# Altium schematic sheet DM3370_PCIe.SchDoc: =project_title
size Tabloid; CompanyName: Luxonis Holding; Organization: Luxonis Holding; Address1: 1925 Harmony Park Drive; Address2: Westminster, CO; Address3: 80234; Address4: United States; DocumentNumber: 12; SheetNumber: 12; SheetTotal: 17
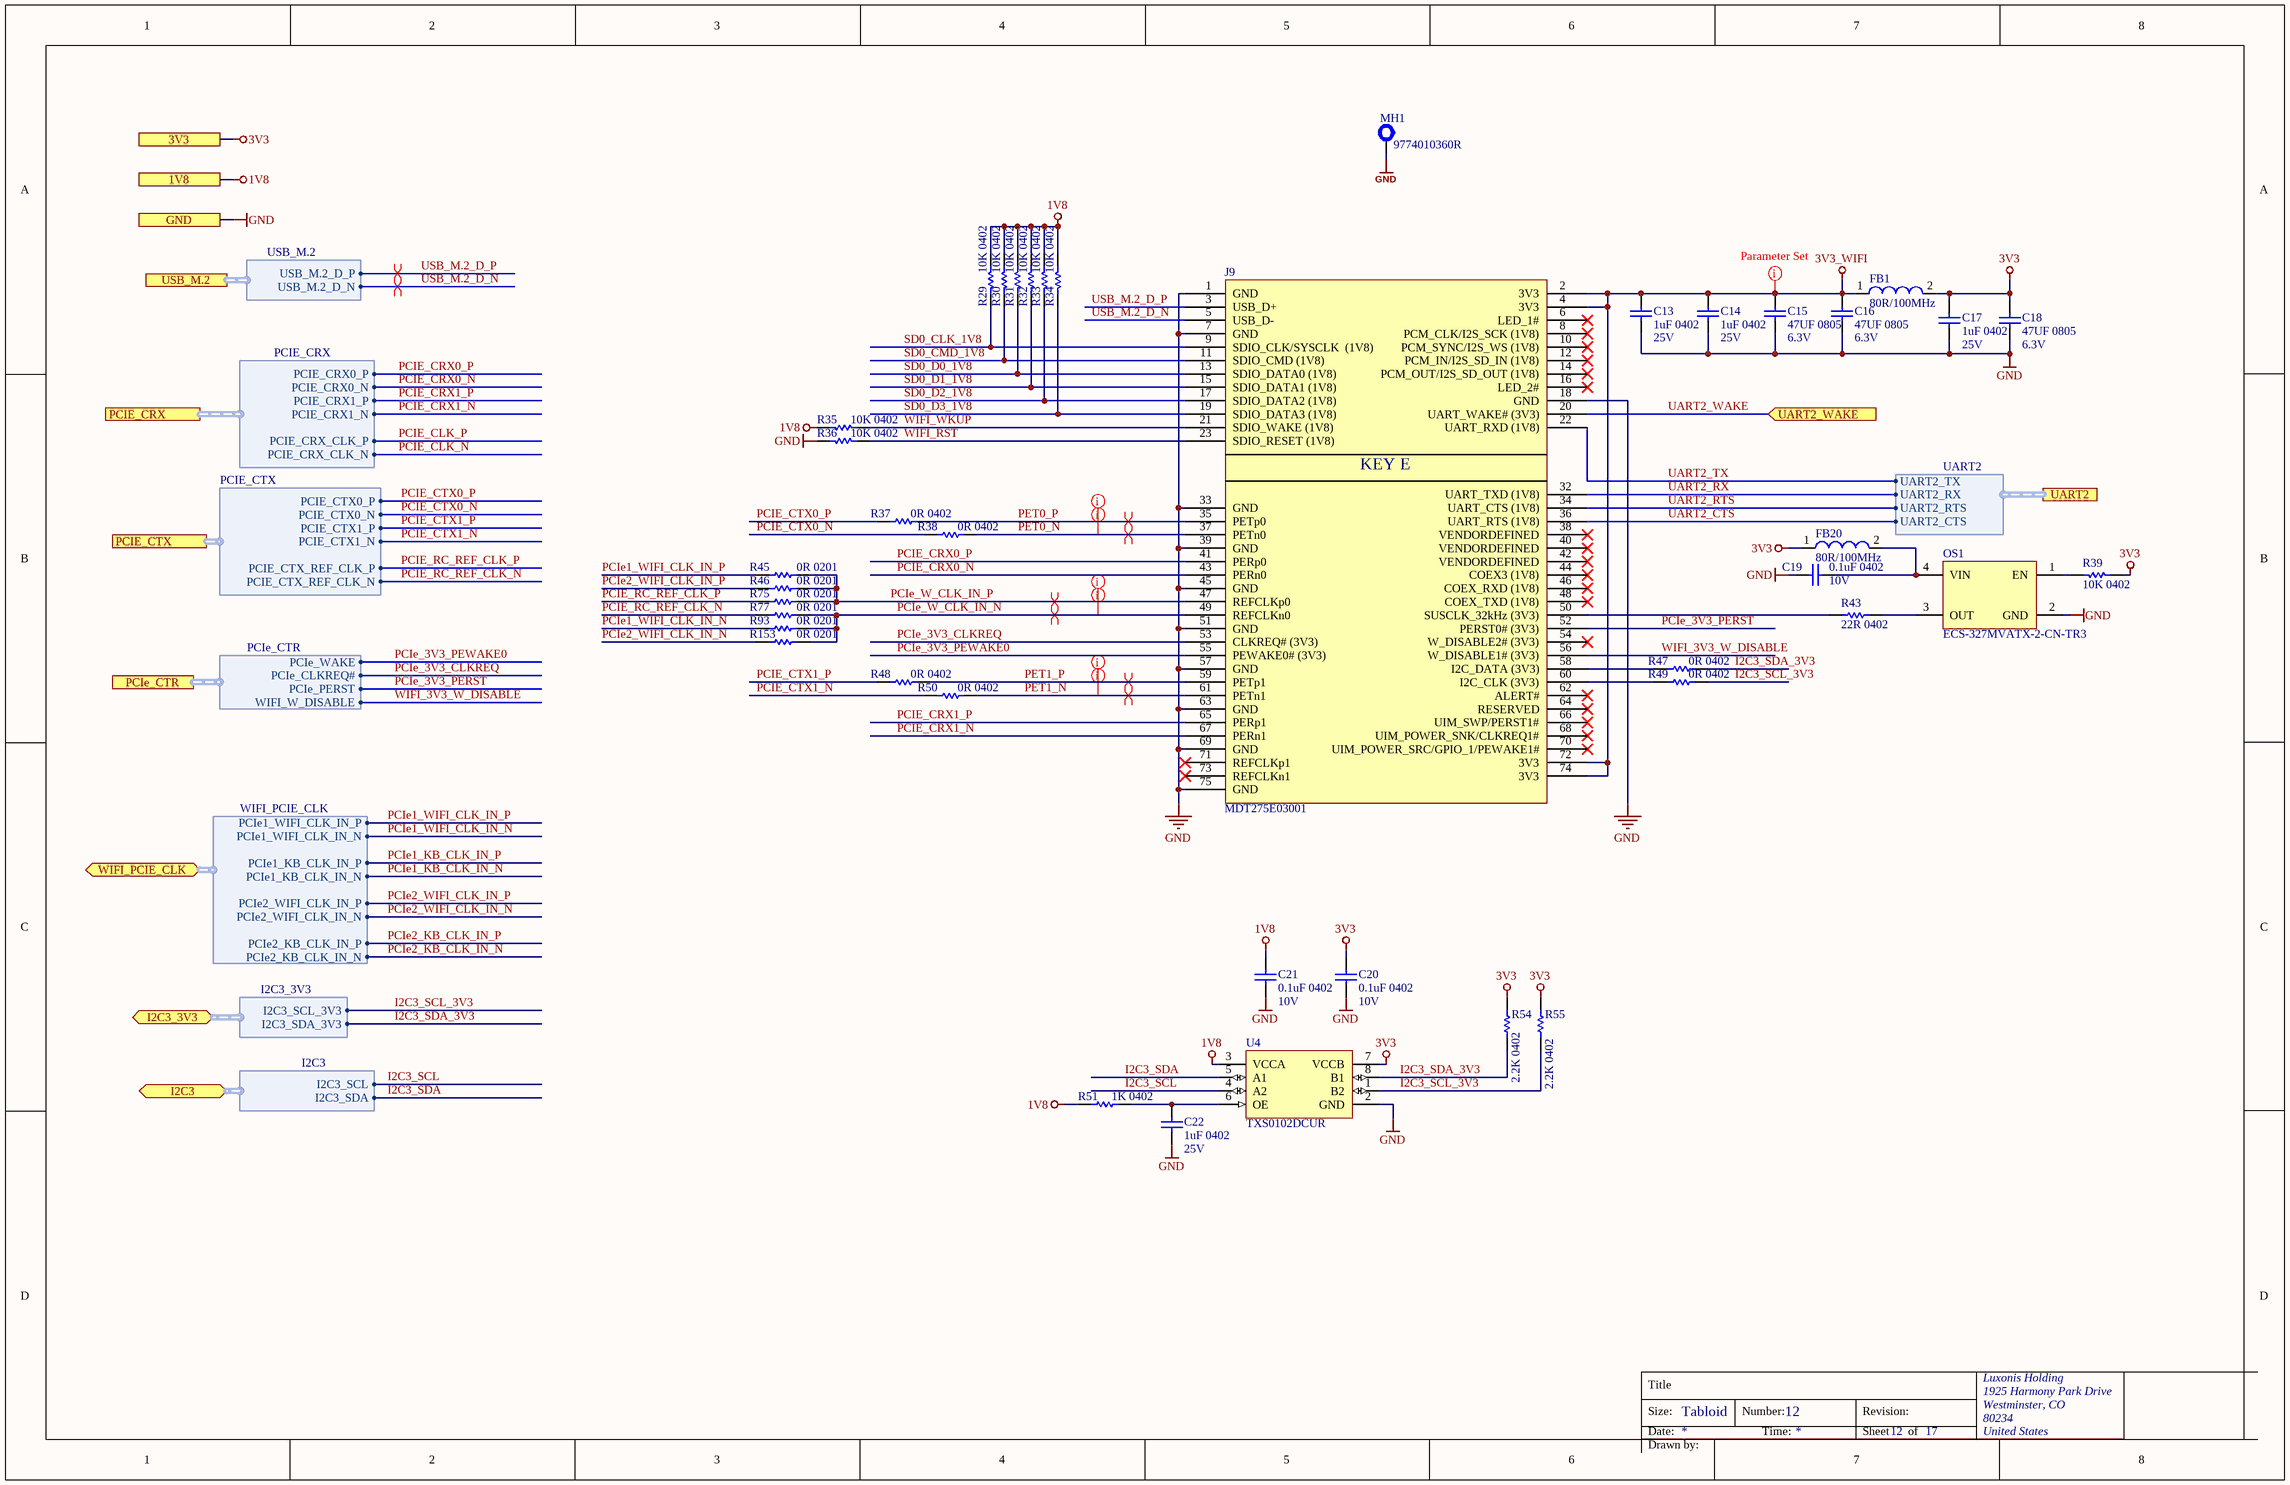
[diagram p0: DM3370_PCIe.SchDoc]

## Parts
C13  1uF 0402  Voltage Rating: 25V  [CAPC0402(1005)70_L]
C14  1uF 0402  Voltage Rating: 25V  [CAPC0402(1005)70_L]
C15  47UF 0805  Voltage: 6.3V  [CAPC0805(2012)145_L]
C16  47UF 0805  Voltage: 6.3V  [CAPC0805(2012)145_L]
C17  1uF 0402  Voltage Rating: 25V  [CAPC0402(1005)70_L]
C18  47UF 0805  Voltage: 6.3V  [CAPC0805(2012)145_L]
C19  0.1uF 0402  Voltage Rating: 10V  [CAPC0402(1005)70_L]
C20  0.1uF 0402  Voltage Rating: 10V  [CAPC0402(1005)70_L]
C21  0.1uF 0402  Voltage Rating: 10V  [CAPC0402(1005)70_L]
C22  1uF 0402  Voltage Rating: 25V  [CAPC0402(1005)70_L]
FB1  80R/100MHz  [BK1608HS800-T_L]
FB20  80R/100MHz  [BK1608HS800-T_L]
J9  MDT275E03001  [MDT275E]
MH1  9774010360R  [9774010360R]
OS1  ECS-327MVATX-2-CN-TR3  [2520_OSC(FJ2400002)]
R29  10K 0402  [RESC0402(1005)_L]
R30  10K 0402  [RESC0402(1005)_L]
R31  10K 0402  [RESC0402(1005)_L]
R32  10K 0402  [RESC0402(1005)_L]
R33  10K 0402  [RESC0402(1005)_L]
R34  10K 0402  [RESC0402(1005)_L]
R35  10K 0402  [RESC0402(1005)_L]
R36  10K 0402  [RESC0402(1005)_L]
R37  0R 0402  [RESC0402(1005)_L]
R38  0R 0402  [RESC0402(1005)_L]
R39  10K 0402  [RESC0402(1005)_L]
R43  22R 0402  [RESC0402(1005)_L]
R45  0R 0201  [RESC0201(0603)_L]
R46  0R 0201  [RESC0201(0603)_L]
R47  0R 0402  [RESC0402(1005)_L]
R48  0R 0402  [RESC0402(1005)_L]
R49  0R 0402  [RESC0402(1005)_L]
R50  0R 0402  [RESC0402(1005)_L]
R51  1K 0402  [RESC0402(1005)_L]
R54  2.2K 0402  [RESC0402(1005)_L]
R55  2.2K 0402  [RESC0402(1005)_L]
R75  0R 0201  [RESC0201(0603)_L]
R77  0R 0201  [RESC0201(0603)_L]
R93  0R 0201  [RESC0201(0603)_L]
R153  0R 0201  [RESC0201(0603)_L]
U4  TXS0102DCUR  [TXS0102DCUR]

## Ports
1V8, 3V3, GND, I2C3 (bidir, harness I2C3), I2C3_3V3 (bidir, harness I2C3_3V3), PCIE_CRX (harness PCIE_CRX), PCIe_CTR (harness PCIe_CTR), PCIE_CTX (harness PCIE_CTX), UART2 (harness UART2), UART2_WAKE (in), USB_M.2 (harness USB_M.2), WIFI_PCIE_CLK (bidir, harness WIFI_PCIE_CLK)

## Harnesses
PCIE_CRX: PCIE_CRX0_P, PCIE_CRX0_N, PCIE_CRX1_P, PCIE_CRX1_N, PCIE_CRX_CLK_P, PCIE_CRX_CLK_N
PCIE_CTX: PCIE_CTX0_P, PCIE_CTX0_N, PCIE_CTX1_P, PCIE_CTX1_N, PCIE_CTX_REF_CLK_P, PCIE_CTX_REF_CLK_N
PCIe_CTR: PCIe_CLKREQ#, PCIe_PERST, PCIe_WAKE, WIFI_W_DISABLE
UART2: UART2_TX, UART2_RX, UART2_CTS, UART2_RTS
WIFI_PCIE_CLK: PCIe1_WIFI_CLK_IN_P, PCIe1_WIFI_CLK_IN_N, PCIe1_KB_CLK_IN_P, PCIe1_KB_CLK_IN_N, PCIe2_WIFI_CLK_IN_P, PCIe2_WIFI_CLK_IN_N, PCIe2_KB_CLK_IN_P, PCIe2_KB_CLK_IN_N
I2C3_3V3: I2C3_SCL_3V3, I2C3_SDA_3V3
I2C3: I2C3_SCL, I2C3_SDA
USB_M.2: USB_M.2_D_P, USB_M.2_D_N

## Nets
1V8: C21.2 R29.1 R30.1 R31.1 R32.1 R33.1 R34.1 R35.2 R51.2 U4.3(VCCA) ; port 1V8
3V3: C17.2 C18.2 C20.2 FB1.2 FB20.1 R39.2 R54.2 R55.2 U4.7(VCCB) ; port 3V3
3V3_WIFI: C13.2 C14.2 C15.2 C16.2 FB1.1 J9.2(3V3) J9.4(3V3) J9.72(3V3) J9.74(3V3)
GND: C13.1 C14.1 C15.1 C16.1 C17.1 C18.1 C19.1 C20.1 C21.1 C22.1 J9.1(GND) J9.7(GND) J9.18(GND) J9.33(GND) J9.39(GND) J9.45(GND) J9.51(GND) J9.57(GND) J9.63(GND) J9.69(GND) J9.75(GND) MH1.1 OS1.2(GND) R36.2 U4.2(GND) ; port GND
I2C3_SCL: U4.4(A2) ; port I2C3.I2C3_SCL
I2C3_SCL_3V3: R49.2 R55.1 U4.1(B2) ; port I2C3_3V3.I2C3_SCL_3V3
I2C3_SDA: U4.5(A1) ; port I2C3.I2C3_SDA
I2C3_SDA_3V3: R47.2 R54.1 U4.8(B1) ; port I2C3_3V3.I2C3_SDA_3V3
PCIe1_KB_CLK_IN_N: port WIFI_PCIE_CLK.PCIe1_KB_CLK_IN_N
PCIe1_KB_CLK_IN_P: port WIFI_PCIE_CLK.PCIe1_KB_CLK_IN_P
PCIe1_WIFI_CLK_IN_N: R93.1 ; port WIFI_PCIE_CLK.PCIe1_WIFI_CLK_IN_N
PCIe1_WIFI_CLK_IN_P: R45.1 ; port WIFI_PCIE_CLK.PCIe1_WIFI_CLK_IN_P
PCIe2_KB_CLK_IN_N: port WIFI_PCIE_CLK.PCIe2_KB_CLK_IN_N
PCIe2_KB_CLK_IN_P: port WIFI_PCIE_CLK.PCIe2_KB_CLK_IN_P
PCIe2_WIFI_CLK_IN_N: R153.1 ; port WIFI_PCIE_CLK.PCIe2_WIFI_CLK_IN_N
PCIe2_WIFI_CLK_IN_P: R46.1 ; port WIFI_PCIE_CLK.PCIe2_WIFI_CLK_IN_P
PCIe_3V3_CLKREQ: J9.53(CLKREQ#_(3V3)) ; port PCIe_CTR.PCIe_CLKREQ#
PCIe_3V3_PERST: J9.52(PERST0#_(3V3)) ; port PCIe_CTR.PCIe_PERST
PCIe_3V3_PEWAKE0: J9.55(PEWAKE0#_(3V3)) ; port PCIe_CTR.PCIe_WAKE
PCIE_CLK_N: port PCIE_CRX.PCIE_CRX_CLK_N
PCIE_CLK_P: port PCIE_CRX.PCIE_CRX_CLK_P
PCIE_CRX0_N: J9.43(PERn0) ; port PCIE_CRX.PCIE_CRX0_N
PCIE_CRX0_P: J9.41(PERp0) ; port PCIE_CRX.PCIE_CRX0_P
PCIE_CRX1_N: J9.67(PERn1) ; port PCIE_CRX.PCIE_CRX1_N
PCIE_CRX1_P: J9.65(PERp1) ; port PCIE_CRX.PCIE_CRX1_P
PCIE_CTX0_N: R38.1 ; port PCIE_CTX.PCIE_CTX0_N
PCIE_CTX0_P: R37.1 ; port PCIE_CTX.PCIE_CTX0_P
PCIE_CTX1_N: R50.1 ; port PCIE_CTX.PCIE_CTX1_N
PCIE_CTX1_P: R48.1 ; port PCIE_CTX.PCIE_CTX1_P
PCIE_RC_REF_CLK_N: R77.1 ; port PCIE_CTX.PCIE_CTX_REF_CLK_N
PCIE_RC_REF_CLK_P: R75.1 ; port PCIE_CTX.PCIE_CTX_REF_CLK_P
PCIe_W_CLK_IN_N: J9.49(REFCLKn0) R77.2 R93.2 R153.2
PCIe_W_CLK_IN_P: J9.47(REFCLKp0) R45.2 R46.2 R75.2
PET0_N: J9.37(PETn0) R38.2
PET0_P: J9.35(PETp0) R37.2
PET1_N: J9.61(PETn1) R50.2
PET1_P: J9.59(PETp1) R48.2
SD0_CLK_1V8: J9.9(SDIO_CLK/SYSCLK__(1V8)) R29.2
SD0_CMD_1V8: J9.11(SDIO_CMD_(1V8)) R30.2
SD0_D0_1V8: J9.13(SDIO_DATA0_(1V8)) R31.2
SD0_D1_1V8: J9.15(SDIO_DATA1_(1V8)) R32.2
SD0_D2_1V8: J9.17(SDIO_DATA2_(1V8)) R33.2
SD0_D3_1V8: J9.19(SDIO_DATA3_(1V8)) R34.2
UART2_CTS: J9.36(UART_RTS_(1V8)) ; port UART2.UART2_CTS
UART2_RTS: J9.34(UART_CTS_(1V8)) ; port UART2.UART2_RTS
UART2_RX: J9.32(UART_TXD_(1V8)) ; port UART2.UART2_RX
UART2_TX: J9.22(UART_RXD_(1V8)) ; port UART2.UART2_TX
UART2_WAKE: J9.20(UART_WAKE#_(3V3)) ; port UART2_WAKE
USB_M.2_D_N: J9.5(USB_D-) ; port USB_M.2.USB_M.2_D_N
USB_M.2_D_P: J9.3(USB_D+) ; port USB_M.2.USB_M.2_D_P
WIFI_3V3_W_DISABLE: J9.56(W_DISABLE1#_(3V3)) ; port PCIe_CTR.WIFI_W_DISABLE
WIFI_RST: J9.23(SDIO_RESET_(1V8)) R36.1
WIFI_WKUP: J9.21(SDIO_WAKE_(1V8)) R35.1
NetC19_2: C19.2 FB20.2 OS1.4(VIN)
NetC22_2: C22.2 R51.1 U4.6(OE)
NetJ9_50: J9.50(SUSCLK_32kHz_(3V3)) R43.2
NetJ9_58: J9.58(I2C_DATA_(3V3)) R47.1
NetJ9_60: J9.60(I2C_CLK_(3V3)) R49.1
NetOS1_1: OS1.1(EN) R39.1
NetOS1_3: OS1.3(OUT) R43.1

Not connected (* = marked no-connect by the designer): J9 6(LED_1#)* 8(PCM_CLK/I2S_SCK_(1V8))* 10(PCM_SYNC/I2S_WS_(1V8))* 12(PCM_IN/I2S_SD_IN_(1V8))* 14(PCM_OUT/I2S_SD_OUT_(1V8))* 16(LED_2#)* 38(VENDORDEFINED)* 40(VENDORDEFINED)* 42(VENDORDEFINED)* 44(COEX3_(1V8))* 46(COEX_RXD_(1V8))* 48(COEX_TXD_(1V8))* 54(W_DISABLE2#_(3V3))* 62(ALERT#)* 64(RESERVED)* 66(UIM_SWP/PERST1#)* 68(UIM_POWER_SNK/CLKREQ1#)* 70(UIM_POWER_SRC/GPIO_1/PEWAKE1#)* 71(REFCLKp1)* 73(REFCLKn1)*

## Layout directives
differential pair; differential pair class 100ohm; net class PCIE: PCIe_W_CLK_IN_N, PCIe_W_CLK_IN_P, PET0_N, PET0_P, PET1_N, PET1_P
net class POWER: 3V3_WIFI
net class PCIE: PCIe_W_CLK_IN_N, PCIe_W_CLK_IN_P, PET0_N, PET0_P, PET1_N, PET1_P
differential pair; differential pair class 90ohm: USB_M.2_D_N, USB_M.2_D_P

## Notes on the sheet
- Title
- Size:
- Date:
- Tabloid
- Number:
- Time:
- Revision:
- Sheet
- of
- Drawn by:
- (in symbol CMP-002-00122-1) KEY E

## Library data of the parts
C13 C14 C17 C22 = GRM155R61E105KA12D: CAP CER 1UF 25V X5R 0402 10%; Manufacturer 1: Murata; Material: Ceramic; Supplier 1: Digi-Key; Manufacturer Part Number 1: GRM155R61E105KA12D; Stock 1: 200653; Pricing 1: 1=0.10000, 10=0.07100, 100=0.03350, 500=0.02352, 1000=0.01947, 2500=0.01812, 5000=0.01658 (USD); RoHS: Yes; Mount: Surface Mount; Case/Package: 0402; Weight: 0.000212oz; Case Code (Metric): 1005; Case Code (Imperial): 0402; Min Operating Temperature: -55°C; Max Operating Temperature: 85°C; Tolerance: 10%; Capacitance: 1uF; Dielectric: X5R; Voltage Rating (DC): 25V; Packaging: Tape and Reel; Package Quantity: 10000; Termination: SMD/SMT; Voltage: 25V; Length: 1mm; Height: 0.5mm; Width: 0.5mm; Thickness: 0.022inch; Depth: 0.5mm; Lead Free: Lead Free; REACH SVHC: No SVHC; ComponentLink1URL: https://datasheet.ciiva.com/22732/1666664-22732122.pdf?src-supplier=Element14; ComponentLink1Description: https://datasheet.ciiva.com/22732/1666664-22732122.pdf?src-supplier=Element14; ComponentLink2URL: https://datasheet.ciiva.com/7719/1666664-7719006.pdf?src-supplier=Element14; ComponentLink2Description: https://datasheet.ciiva.com/7719/1666664-7719006.pdf?src-supplier=Element14; Supplier Part Number 1: 490-10017-1-ND; Supplier 2: Arrow; Supplier 3: TTI; Supplier Part Number 2: GRM155R61E105KA12D; Supplier Part Number 3: GRM155R61E105KA12D
C15 C16 C18 = GRM21BR60J476ME15L: CAP CER 47UF 6.3V X5R 0805; Manufacturer 1: Murata; Tolerance: 20%; Supplier 1: Digi-Key; Manufacturer Part Number 1: GRM21BR60J476ME15L; Stock 1: 16165; Pricing 1: 1=0.48000, 10=0.33900, 100=0.22360, 500=0.16560, 1000=0.14076 (USD); RoHS: Yes; Mount: Surface Mount; Case/Package: 0805; Weight: 0.000335oz; Case Code (Metric): 2012; Case Code (Imperial): 0805; Min Operating Temperature: -55°C; Max Operating Temperature: 85°C; Voltage Rating: 6.3V; Packaging: Tape and Reel; Capacitance: 47uF; Voltage Rating (DC): 6.3V; Package Quantity: 3000; Termination: SMD/SMT; Dielectric: X5R; Length: 2mm; Height: 1.25mm; Width: 0.049inch; Depth: 1.25mm; Thickness: 0.057inch; Lead Free: Lead Free; REACH SVHC: No SVHC; ComponentLink1URL: https://datasheet.ciiva.com/46444/1754700-46444997.pdf?src-supplier=Element14; ComponentLink1Description: https://datasheet.ciiva.com/46444/1754700-46444997.pdf?src-supplier=Element14; Supplier 2: Newark; Supplier 3: Mouser; Supplier Part Number 1: 490-9960-1-ND; Supplier Part Number 2: 40X5890; Supplier Part Number 3: 81-GRM21BR60J476ME5L
C19-C21 = GRM155R71A104JA01D: CAP CER 0.1UF 10V X7R 0402 5%; Manufacturer 1: Murata; Capacitance: 100nF; Supplier 1: Digi-Key; Manufacturer Part Number 1: GRM155R71A104JA01D; Stock 1: 1346709; Pricing 1: 1=0.10000, 10=0.02500, 100=0.01130, 500=0.00806, 1000=0.00633, 2500=0.00575, 5000=0.00529 (USD); RoHS: Yes; Mount: Surface Mount; Case/Package: 0402; Case Code (Imperial): 0402; Case Code (Metric): 1005; Min Operating Temperature: -55°C; Max Operating Temperature: 125°C; Tolerance: 5%; Packaging: Tape and Reel; Voltage Rating (DC): 10V; Dielectric: X7R; Package Quantity: 10000; Termination: SMD/SMT; Length: 1mm; Height: 0.5mm; Width: 0.02inch; Thickness: 0.022inch; Depth: 0.5mm; Radiation Hardening: No; Lead Free: Lead Free; ComponentLink1URL: https://datasheet.ciiva.com/5411/product-5411135.pdf?src-supplier=Mouser; ComponentLink1Description: https://datasheet.ciiva.com/5411/product-5411135.pdf?src-supplier=Mouser; ComponentLink2URL: https://datasheet.ciiva.com/11618/c02e-11618821.pdf?src-supplier=Avnet; ComponentLink2Description: https://datasheet.ciiva.com/11618/c02e-11618821.pdf?src-supplier=Avnet; Supplier Part Number 1: 490-10777-1-ND
FB1 FB20 = BK1608HS800-T: FERRITE BEAD 80 OHM 0603 1LN; Manufacturer 1: Taiyo Yuden; Impedance: 80R; Tolerance: 25%; Max DC Current: 600mA; DC Resistance (DCR): 100mR; Test Frequency: 100MHz; Number of Lines: 1; Shielding: Shielded; Supplier 1: Digi-Key; Manufacturer Part Number 1: BK1608HS800-T; Stock 1: 6285; Pricing 1: 1=0.10000, 10=0.07900, 25=0.07200, 50=0.06480, 100=0.04760, 250=0.03460, 500=0.03170, 1000=0.02738 (USD); RoHS: Yes; Mount: Surface Mount; Case/Package: 0603; Number of Pins: 2; Core Material: Ferrite; Case Code (Metric): 1608; Case Code (Imperial): 0603; Min Operating Temperature: -55°C; Max Operating Temperature: 125°C; Package Quantity: 1; Packaging: Tape and Reel; Termination: SMD/SMT; Max Current Rating: 600mA; Frequency: 100MHz; Length: 0.063inch; Height: 0.037inch; Width: 0.8mm; Depth: 0.95mm; REACH SVHC: Unknown; Lead Free: Lead Free; Halogen Free: Halogen Free; ComponentLink1URL: https://datasheet.ciiva.com/1011/bk1608hs800-t-ss-1011885.pdf?src-supplier=Digi-Key; ComponentLink1Description: https://datasheet.ciiva.com/1011/bk1608hs800-t-ss-1011885.pdf?src-supplier=Digi-Key; ComponentLink2URL: https://datasheet.ciiva.com/1011/mlci07-e-1011886.pdf?src-supplier=Digi-Key; ComponentLink2Description: https://datasheet.ciiva.com/1011/mlci07-e-1011886.pdf?src-supplier=Digi-Key; ComponentLink3URL: https://datasheet.ciiva.com/1011/mlci07-e-1011887.pdf?src-supplier=Digi-Key; ComponentLink3Description: https://datasheet.ciiva.com/1011/mlci07-e-1011887.pdf?src-supplier=Digi-Key; Supplier 2: Mouser; Supplier 3: Arrow; Supplier Part Number 1: 587-1875-1-ND; Supplier Part Number 2: 963-BK1608HS800-T; Supplier Part Number 3: BK1608HS800-T
J9 = CMP-002-00122-1: Conn Card Edge RCP 67 POS 0.5mm Solder RA SMD; Manufacturer 1: Amphenol Commercial; Stock 1: 1980; Manufacturer Part Number 1: MDT275E03001; Design Item ID: MDT420E03001; Category: Card Edge Connectors; RoHS: Yes
MH1 = CMP-00015-1: Spacers/Standoffs; Manufacturer 1: Wuerth; Manufacturer Part Number 1: 9774010360R
OS1 = CMP-016-000027-1: SMD Crystal Oscillator 32.768KHz 1.6V to 3.6V 15pF 4-Pin Miniature CSMD T/R; Manufacturer 1: ECS International; Pricing 1: 1=1,12000, 10=0,98900, 50=0,92440, 100=0,81700, 500=0,77400, 1000=0,64500 (USD); RoHS: No; Design Item ID: ECS-327MVATX-2-CN-TR3; Manufacturer Part Number 1: ECS-327MVATX-2-CN-TR3; Source: LuxonisMaster.SchLib; Stock 1: 3071
R29-R36 R39 = RC0402FR-1310KL: RES SMD 10K OHM 1% 0402 1/16W Chip Resistor, 0402 [1005 Metric], 10 kohm, RC Series, 50 V, Thick Film, 62.5 mW; Manufacturer 1: Yageo; Resistance: 10kR; Temperature Coefficient: 100ppm/°C; Power Rating: 62.5mW; Voltage Rating: 50V; ComponentLink1URL: https://datasheet.ciiva.com/16940/pyu-rc0402-51-rohs-l-6-16940293.pdf?src-supplier=Avnet+Europe; ComponentLink1Description: https://datasheet.ciiva.com/16940/pyu-rc0402-51-rohs-l-6-16940293.pdf?src-supplier=Avnet+Europe; ComponentLink2URL: https://datasheet.ciiva.com/28386/pyu-rc0402-51-rohs-l-6-28386855.pdf?src-supplier=Avnet+Europe; ComponentLink2Description: https://datasheet.ciiva.com/28386/pyu-rc0402-51-rohs-l-6-28386855.pdf?src-supplier=Avnet+Europe; ComponentLink3URL: https://datasheet.ciiva.com/16740/pyu-rc0402-51-rohs-l-6-r-16740602.pdf?src-supplier=Future+Electronics; ComponentLink3Description: https://datasheet.ciiva.com/16740/pyu-rc0402-51-rohs-l-6-r-16740602.pdf?src-supplier=Future+Electronics; ComponentLink4URL: https://datasheet.ciiva.com/8891/pyu-rc0402-51-rohs-l-6-8891339.pdf?src-supplier=Avnet; ComponentLink4Description: https://datasheet.ciiva.com/8891/pyu-rc0402-51-rohs-l-6-8891339.pdf?src-supplier=Avnet; ComponentLink5URL: https://datasheet.ciiva.com/5557/pyu-rc0402-51-rohs-l-6-r-5557997.pdf?src-supplier=Mouser; ComponentLink5Description: https://datasheet.ciiva.com/5557/pyu-rc0402-51-rohs-l-6-r-5557997.pdf?src-supplier=Mouser; ComponentLink6URL: https://datasheet.ciiva.com/7983/1018594-7983533.pdf?src-supplier=Element14; ComponentLink6Description: https://datasheet.ciiva.com/7983/1018594-7983533.pdf?src-supplier=Element14; Supplier 1: Newark; Manufacturer Part Number 1: RC0402FR-1310KL; Stock 1: 62239; Pricing 1: 1=0.10000, 25=0.01200, 100=0.00400, 250=0.00400, 500=0.00300, 1000=0.00300 (USD); RoHS: Yes; Case/Package: 0402; Number of Pins: 2; Contact Plating: Tin,Matte,Lead; Case Code (Imperial): 0402; Case Code (Metric): 1005; Min Operating Temperature: -55°C; Max Operating Temperature: 155°C; Tolerance: 1%; Composition: Thick Film; Packaging: Tape and Reel; Termination: SMD/SMT; Military Standard: Not; Voltage Rating (DC): 50V; Working Voltage: 50V; Number of Terminations: 2; Length: 1mm; Depth: 0.5mm; Radiation Hardening: No; REACH SVHC: No SVHC; Lead Free: Lead Free; Supplier Part Number 1: 67R9960
  R29-R36: Supplier 2: Future Electronics; Supplier 3: Mouser; Supplier 4: Element14; Supplier Part Number 2: RC0402FR-1310KL-CUTT; Supplier Part Number 3: 603-RC0402FR-1310KL; Supplier Part Number 4: 1799235
R37 R38 R47-R50 = CRCW04020000Z0ED: RES SMD 0 OHM JUMPER 1/16W 0402; Manufacturer 1: Vishay; Resistance: 0mR; Power Rating: 63mW; Voltage Rating: 50V; Temperature Coefficient: 100ppm/°C; Tolerance: 5%; Supplier 1: Digi-Key; Manufacturer Part Number 1: CRCW04020000Z0ED; Stock 1: 855968; Pricing 1: 1=0.10000, 10=0.03400, 25=0.02440, 50=0.01860, 100=0.01380, 250=0.01048, 500=0.00840, 1000=0.00618, 5000=0.00443 (USD); RoHS: Yes; Mount: Surface Mount; Case/Package: 0402; Weight: 2.3E-05oz; Case Code (Imperial): 0402; Case Code (Metric): 1005; Contact Plating: Tin; Min Operating Temperature: -55°C; Max Operating Temperature: 155°C; Packaging: Tape and Reel; Composition: Thick Film; Voltage Rating (DC): 50V; Package Quantity: 1; Termination: SMD/SMT; Number of Terminations: 2; Military Standard: Not; Max Power Dissipation: 63mW; Features: Automotive AEC-Q200; Length: 1mm; Height: 0.35mm; Width: 0.5mm; Depth: 0.5mm; Radiation Hardening: No; REACH SVHC: Unknown; Lead Free: Lead Free; ComponentLink1URL: https://datasheet.ciiva.com/3255/dcrcwe3-3255944.pdf?src-supplier=Avnet; ComponentLink1Description: https://datasheet.ciiva.com/3255/dcrcwe3-3255944.pdf?src-supplier=Avnet; ComponentLink2URL: https://datasheet.ciiva.com/3255/dcrcwe3-3255945.pdf?src-supplier=Avnet; ComponentLink2Description: https://datasheet.ciiva.com/3255/dcrcwe3-3255945.pdf?src-supplier=Avnet; ComponentLink3URL: https://datasheet.ciiva.com/16881/dcrcwe3-16881413.pdf?src-supplier=Avnet+Europe; ComponentLink3Description: https://datasheet.ciiva.com/16881/dcrcwe3-16881413.pdf?src-supplier=Avnet+Europe; ComponentLink4URL: https://datasheet.ciiva.com/2461/dcrcwe3-2461962.pdf?src-supplier=Digi-Key; ComponentLink4Description: https://datasheet.ciiva.com/2461/dcrcwe3-2461962.pdf?src-supplier=Digi-Key; ComponentLink5URL: https://datasheet.ciiva.com/7841/1720486-7841802.pdf?src-supplier=Element14; ComponentLink5Description: https://datasheet.ciiva.com/7841/1720486-7841802.pdf?src-supplier=Element14; ComponentLink6URL: https://datasheet.ciiva.com/2461/dcrcwe3-2461963.pdf?src-supplier=Digi-Key; ComponentLink6Description: https://datasheet.ciiva.com/2461/dcrcwe3-2461963.pdf?src-supplier=Digi-Key; ComponentLink7URL: https://datasheet.ciiva.com/2461/dcrcwe3-2461964.pdf?src-supplier=Digi-Key; ComponentLink7Description: https://datasheet.ciiva.com/2461/dcrcwe3-2461964.pdf?src-supplier=Digi-Key; ComponentLink8URL: https://datasheet.ciiva.com/7841/1697337-7841468.pdf?src-supplier=Element14; ComponentLink8Description: https://datasheet.ciiva.com/7841/1697337-7841468.pdf?src-supplier=Element14; ComponentLink9URL: https://datasheet.ciiva.com/16761/70200976-16761309.pdf?src-supplier=Allied+Electronics; ComponentLink9Description: https://datasheet.ciiva.com/16761/70200976-16761309.pdf?src-supplier=Allied+Electronics; ComponentLink10URL: https://datasheet.ciiva.com/26311/fld-crcw-e3-data-en-26311550.pdf?src-supplier=Distrelec; ComponentLink10Description: https://datasheet.ciiva.com/26311/fld-crcw-e3-data-en-26311550.pdf?src-supplier=Distrelec; Supplier Part Number 1: 541-0.0JCT-ND
R43 = RC0402FR-0722RL: RES SMD 22 OHM 1% 1/16W 0402; Manufacturer 1: Yageo; Temperature Coefficient: 100ppm/°C; Power Rating: 63mW; Voltage Rating: 50V; Supplier 1: Digi-Key; Manufacturer Part Number 1: RC0402FR-0722RL; Stock 1: 24616988; Pricing 1: 1=0.10000, 10=0.01600, 100=0.00640, 1000=0.00289, 2500=0.00251, 5000=0.00207 (USD); RoHS: Yes; Case/Package: 0402; Number of Pins: 2; Case Code (Metric): 1005; Case Code (Imperial): 0402; Min Operating Temperature: -55°C; Max Operating Temperature: 155°C; Tolerance: 1%; Resistance: 22R; Packaging: Tape and Reel; Composition: Thick Film; Voltage Rating (DC): 50V; Termination: SMD/SMT; Military Standard: Not; Length: 1mm; Height: 0.32mm; Width: 0.5mm; Depth: 0.5mm; REACH SVHC: Unknown; Lead Free: Lead Free; ComponentLink1URL: https://datasheet.ciiva.com/11819/0900766b80c66297-11819462.pdf?src-supplier=RSComponents; ComponentLink1Description: https://datasheet.ciiva.com/11819/0900766b80c66297-11819462.pdf?src-supplier=RSComponents; ComponentLink2URL: https://datasheet.ciiva.com/7849/1018594-7849911.pdf?src-supplier=Element14; ComponentLink2Description: https://datasheet.ciiva.com/7849/1018594-7849911.pdf?src-supplier=Element14; ComponentLink3URL: https://datasheet.ciiva.com/26829/getdatasheetpartid-554995-26829991.pdf?src-supplier=Verical; ComponentLink3Description: https://datasheet.ciiva.com/26829/getdatasheetpartid-554995-26829991.pdf?src-supplier=Verical; ComponentLink4URL: https://datasheet.ciiva.com/7849/1018594-7849912.pdf?src-supplier=Element14; ComponentLink4Description: https://datasheet.ciiva.com/7849/1018594-7849912.pdf?src-supplier=Element14; ComponentLink5URL: https://datasheet.ciiva.com/16930/pyu-rc0402-51-rohs-l-6-r-16930687.pdf?src-supplier=Future+Electronics; ComponentLink5Description: https://datasheet.ciiva.com/16930/pyu-rc0402-51-rohs-l-6-r-16930687.pdf?src-supplier=Future+Electronics; Supplier 2: Newark; Supplier 3: Mouser; Supplier Part Number 2: 26M6784; Supplier Part Number 3: 603-RC0402FR-0722RL; Supplier Part Number 1: 311-22.0LRCT-ND; Category: Chip SMD Resistors
R45 R46 R75 R77 R93 R153 = CRCW02010000Z0ED: RES SMD 0 OHM JUMPER 1/16W 0201; Manufacturer 1: Vishay; Rated Power Dissipation (P): 50mW; Rated Temperature: 70°C; Package Height: 0.23mm; Package Length: 0.6mm; Package Width: 0.3mm; Reference Standard: AEC-Q200; Supplier 1: Newark; Manufacturer Part Number 1: CRCW02010000Z0ED; RoHS: Yes; Category: Chip SMD Resistors; Stock 1: 200000; Pricing 1: 1=0,03600, 10000=0,03600, 30000=0,03400 (USD); Mount: Surface Mount; Number of Pins: 2; Package Shape: Rectangular; Size Code: 0201; Terminal Finish: Nickel; Min Operating Temperature: -55°C; Max Operating Temperature: 155°C; JESD-609 Code: e3; Resistor Type: FIXED RESISTOR; Construction: Chip; Package Style: SMTMeter; Packaging: Tape and Reel; Resistance: 0R; Technology: METAL GLAZE/THICK FILM; Termination: Wraparound; REACH SVHC: Yes; RoHS Compliant: Yes; ComponentLink1URL: https://datasheet.ciiva.com:443/pdfs/VipMasterIC/IC/VISH/VISH-S-A0002932828/VISH-S-A0002932828-1.pdf?src-supplier=IHS+Markit; ComponentLink1Description: https://datasheet.ciiva.com:443/pdfs/VipMasterIC/IC/VISH/VISH-S-A0002932828/VISH-S-A0002932828-1.pdf?src-supplier=IHS+Markit; ComponentLink2URL: https://datasheet.ciiva.com/2471/crcw0201e3-2471712.pdf?src-supplier=Digi-Key; ComponentLink2Description: https://datasheet.ciiva.com/2471/crcw0201e3-2471712.pdf?src-supplier=Digi-Key; ComponentLink3URL: https://datasheet.ciiva.com/2471/crcw0201e3-2471713.pdf?src-supplier=Digi-Key; ComponentLink3Description: https://datasheet.ciiva.com/2471/crcw0201e3-2471713.pdf?src-supplier=Digi-Key; ComponentLink4URL: https://datasheet.ciiva.com/7841/1719906-7841431.pdf?src-supplier=Element14; ComponentLink4Description: https://datasheet.ciiva.com/7841/1719906-7841431.pdf?src-supplier=Element14; ComponentLink5URL: https://datasheet.ciiva.com/22665/1847332-22665688.pdf?src-supplier=Element14; ComponentLink5Description: https://datasheet.ciiva.com/22665/1847332-22665688.pdf?src-supplier=Element14; ComponentLink6URL: https://datasheet.ciiva.com/2471/crcw0201e3-2471711.pdf?src-supplier=Digi-Key; ComponentLink6Description: https://datasheet.ciiva.com/2471/crcw0201e3-2471711.pdf?src-supplier=Digi-Key; ComponentLink7URL: https://datasheet.ciiva.com/7841/1719906-7841430.pdf?src-supplier=Element14; ComponentLink7Description: https://datasheet.ciiva.com/7841/1719906-7841430.pdf?src-supplier=Element14; ComponentLink8URL: https://datasheet.ciiva.com/16757/70202042-16757849.pdf?src-supplier=Allied+Electronics; ComponentLink8Description: https://datasheet.ciiva.com/16757/70202042-16757849.pdf?src-supplier=Allied+Electronics; ComponentLink9URL: https://datasheet.ciiva.com/16436/crcw0201e3-16436237.pdf?src-supplier=Future+Electronics; ComponentLink9Description: https://datasheet.ciiva.com/16436/crcw0201e3-16436237.pdf?src-supplier=Future+Electronics; Supplier Part Number 1: 24W1433
R51 = RC0402FR-071KL: RES SMD 1K OHM 1% 1/16W 0402 1 kOhms ±1% 0.063W, 1/16W Chip Resistor 0402 (1005 Metric) Moisture Resistant Thick Film; Manufacturer 1: Yageo; Temperature Coefficient: 100ppm/°C; Power Rating: 62.5mW; Voltage Rating (DC): 50V; Resistance: 1kR; RoHS: Yes; Number of Pins: 2; Case Code (Imperial): 0402; Case Code (Metric): 1005; Min Operating Temperature: -55°C; Max Operating Temperature: 155°C; Packaging: Tape and Reel; Composition: Thick Film; Voltage Rating: 50V; Military Standard: Not; Termination: SMD/SMT; Length: 1mm; Height: 0.32mm; Width: 0.5mm; Depth: 0.5mm; Lead Free: Lead Free; REACH SVHC: Unknown; ComponentLink1URL: https://datasheet.ciiva.com/11819/0900766b80c66297-11819477.pdf?src-supplier=RSComponents; ComponentLink1Description: https://datasheet.ciiva.com/11819/0900766b80c66297-11819477.pdf?src-supplier=RSComponents; ComponentLink2URL: https://datasheet.ciiva.com/12666/pyu-rc0402-51-rohs-l-6-r-12666741.pdf?src-supplier=Mouser; ComponentLink2Description: https://datasheet.ciiva.com/12666/pyu-rc0402-51-rohs-l-6-r-12666741.pdf?src-supplier=Mouser; ComponentLink3URL: https://datasheet.ciiva.com/17063/pyu-rc0402-51-rohs-l-6-r-17063193.pdf?src-supplier=Future+Electronics; ComponentLink3Description: https://datasheet.ciiva.com/17063/pyu-rc0402-51-rohs-l-6-r-17063193.pdf?src-supplier=Future+Electronics; ComponentLink4URL: https://datasheet.ciiva.com/22747/1018594-22747513.pdf?src-supplier=Element14; ComponentLink4Description: https://datasheet.ciiva.com/22747/1018594-22747513.pdf?src-supplier=Element14; ComponentLink5URL: https://datasheet.ciiva.com/7849/1018594-7849869.pdf?src-supplier=Element14; ComponentLink5Description: https://datasheet.ciiva.com/7849/1018594-7849869.pdf?src-supplier=Element14; ComponentLink6URL: https://datasheet.ciiva.com/7983/1018594-7983502.pdf?src-supplier=Element14; ComponentLink6Description: https://datasheet.ciiva.com/7983/1018594-7983502.pdf?src-supplier=Element14; ComponentLink7URL: https://datasheet.ciiva.com/7849/1018594-7849871.pdf?src-supplier=Element14; ComponentLink7Description: https://datasheet.ciiva.com/7849/1018594-7849871.pdf?src-supplier=Element14; Supplier 1: Digi-Key; Manufacturer Part Number 1: RC0402FR-071KL; Stock 1: 60695854; Pricing 1: 1=0.10000, 10=0.01600, 100=0.00670, 1000=0.00301, 2500=0.00261, 5000=0.00215 (USD); Case/Package: 0402; Tolerance: 1%; Supplier Part Number 1: 311-1.00KLRCT-ND
R54 R55 = RC0402FR-072K2L: RES SMD 2.2K OHM 1% 1/16W 0402; Manufacturer 1: Yageo; Resistance: 2.2kR; Temperature Coefficient: 100ppm/°C; Power Rating: 63mW; Voltage Rating: 50V; Supplier 1: Digi-Key; Manufacturer Part Number 1: RC0402FR-072K2L; Stock 1: 12579098; Pricing 1: 1=0.10000, 10=0.01600, 100=0.00640, 1000=0.00289, 2500=0.00251, 5000=0.00207 (USD); RoHS: Yes; Case/Package: 0402; Weight: 2.3E-05oz; Case Code (Imperial): 0402; Case Code (Metric): 1005; Min Operating Temperature: -55°C; Max Operating Temperature: 155°C; Packaging: Tape and Reel; Tolerance: 1%; Composition: Thick Film; Termination: SMD/SMT; Military Standard: Not; Length: 1mm; Height: 0.35mm; Width: 0.5mm; Depth: 0.5mm; Lead Free: Lead Free; REACH SVHC: Unknown; ComponentLink1URL: https://datasheet.ciiva.com/11808/0900766b80c66297-11808786.pdf?src-supplier=RSComponents; ComponentLink1Description: https://datasheet.ciiva.com/11808/0900766b80c66297-11808786.pdf?src-supplier=RSComponents; ComponentLink2URL: https://datasheet.ciiva.com/12577/pyu-rc0402-51-rohs-l-6-r-12577429.pdf?src-supplier=Mouser; ComponentLink2Description: https://datasheet.ciiva.com/12577/pyu-rc0402-51-rohs-l-6-r-12577429.pdf?src-supplier=Mouser; ComponentLink3URL: https://datasheet.ciiva.com/16741/pyu-rc0402-51-rohs-l-6-r-16741015.pdf?src-supplier=Future+Electronics; ComponentLink3Description: https://datasheet.ciiva.com/16741/pyu-rc0402-51-rohs-l-6-r-16741015.pdf?src-supplier=Future+Electronics; ComponentLink4URL: https://datasheet.ciiva.com/7983/1018594-7983515.pdf?src-supplier=Element14; ComponentLink4Description: https://datasheet.ciiva.com/7983/1018594-7983515.pdf?src-supplier=Element14; ComponentLink5URL: https://datasheet.ciiva.com/46383/1018594-46383563.pdf?src-supplier=Element14; ComponentLink5Description: https://datasheet.ciiva.com/46383/1018594-46383563.pdf?src-supplier=Element14; ComponentLink6URL: https://datasheet.ciiva.com/7849/1018594-7849928.pdf?src-supplier=Element14; ComponentLink6Description: https://datasheet.ciiva.com/7849/1018594-7849928.pdf?src-supplier=Element14; ComponentLink7URL: https://datasheet.ciiva.com/7849/1018594-7849929.pdf?src-supplier=Element14; ComponentLink7Description: https://datasheet.ciiva.com/7849/1018594-7849929.pdf?src-supplier=Element14; Supplier 2: Mouser; Supplier 3: Newark; Supplier Part Number 1: 311-2.20KLRCT-ND; Supplier Part Number 2: 603-RC0402FR-072K2L; Supplier Part Number 3: 98K7523
U4 = CMP-113-000005-1: TEXAS INSTRUMENTS - TXS0102DCUR - IC, TRANSLATOR, 2 BIT, BI, US-8; Turn-On Delay Time: 260ns; Max Supply Voltage: 5.5V; Min Supply Voltage: 1.65V; Output Current: 1A; Propagation Delay: 4.6ns; Nominal Supply Current: 14.4uA; High Level Output Current: -20uA; Number of Inputs: 2; Output Type: Voltage; Data Rate: 24Mbps; Low Level Output Current: 1mA; Packaging: Tape and Reel; ComponentLink9URL: https://datasheet.ciiva.com/14287/txs0102-14287518.pdf?src-supplier=Avnet; Min Operating Temperature: -40°C; Max Operating Temperature: 85°C; Radiation Hardening: No; Category: Logic Gates; Lead Free: Lead Free; ComponentLink5Description: https://datasheet.ciiva.com/1899/txs0102-1899369.pdf?src-supplier=Digi-Key; ComponentLink4Description: https://datasheet.ciiva.com/1899/txs0102-1899368.pdf?src-supplier=Digi-Key; Design Item ID: TXS0102DCUR; ComponentLink8URL: https://datasheet.ciiva.com/28499/1863639-28499676.pdf?src-supplier=Element14; Number of Pins: 8; Package Quantity: 1; Pricing 1: 1=0.75000, 10=0.65900, 25=0.61960, 100=0.50550, 250=0.46956, 500=0.39964, 1000=0.31971 (USD); Source: BW2098POE_1.SCHLIB; ComponentLink2Description: https://datasheet.ciiva.com/22653/1846850-22653373.pdf?src-supplier=Farnell; ComponentLink10URL: https://datasheet.ciiva.com/46395/1863639-46395871.pdf?src-supplier=Element14; ComponentLink10Description: https://datasheet.ciiva.com/46395/1863639-46395871.pdf?src-supplier=Element14; ComponentLink2URL: https://datasheet.ciiva.com/22653/1846850-22653373.pdf?src-supplier=Farnell; ComponentLink4URL: https://datasheet.ciiva.com/1899/txs0102-1899368.pdf?src-supplier=Digi-Key; ComponentLink1URL: https://datasheet.ciiva.com/15096/getdatasheetpartid-118249-15096172.pdf?src-supplier=Verical; ComponentLink6URL: https://datasheet.ciiva.com/1899/txs0102-1899370.pdf?src-supplier=Digi-Key; Weight: 0.000339oz; Number of Channels: 2; ComponentLink5URL: https://datasheet.ciiva.com/1899/txs0102-1899369.pdf?src-supplier=Digi-Key; Quiescent Current: 14.4uA; ComponentLink3URL: https://datasheet.ciiva.com/1508/1857232-1508821.pdf?src-supplier=Element14; Manufacturer 1: Texas Instruments; ComponentLink7URL: https://datasheet.ciiva.com/14287/txs0102-14287516.pdf?src-supplier=Avnet; ComponentLink7Description: https://datasheet.ciiva.com/14287/txs0102-14287516.pdf?src-supplier=Avnet; Manufacturer Part Number 1: TXS0102DCUR; ComponentLink3Description: https://datasheet.ciiva.com/1508/1857232-1508821.pdf?src-supplier=Element14; Logic Function: Translator; ComponentLink9Description: https://datasheet.ciiva.com/14287/txs0102-14287518.pdf?src-supplier=Avnet; Case/Package: VSSOP; RoHS: Yes; ComponentLink8Description: https://datasheet.ciiva.com/28499/1863639-28499676.pdf?src-supplier=Element14; ComponentLink1Description: https://datasheet.ciiva.com/15096/getdatasheetpartid-118249-15096172.pdf?src-supplier=Verical; ComponentLink6Description: https://datasheet.ciiva.com/1899/txs0102-1899370.pdf?src-supplier=Digi-Key; Stock 1: 55123; Number of Bits: 2; REACH SVHC: No SVHC